# EAGLE design cdf-modular-bridge-rev2 (EAGLE 7.3.0)
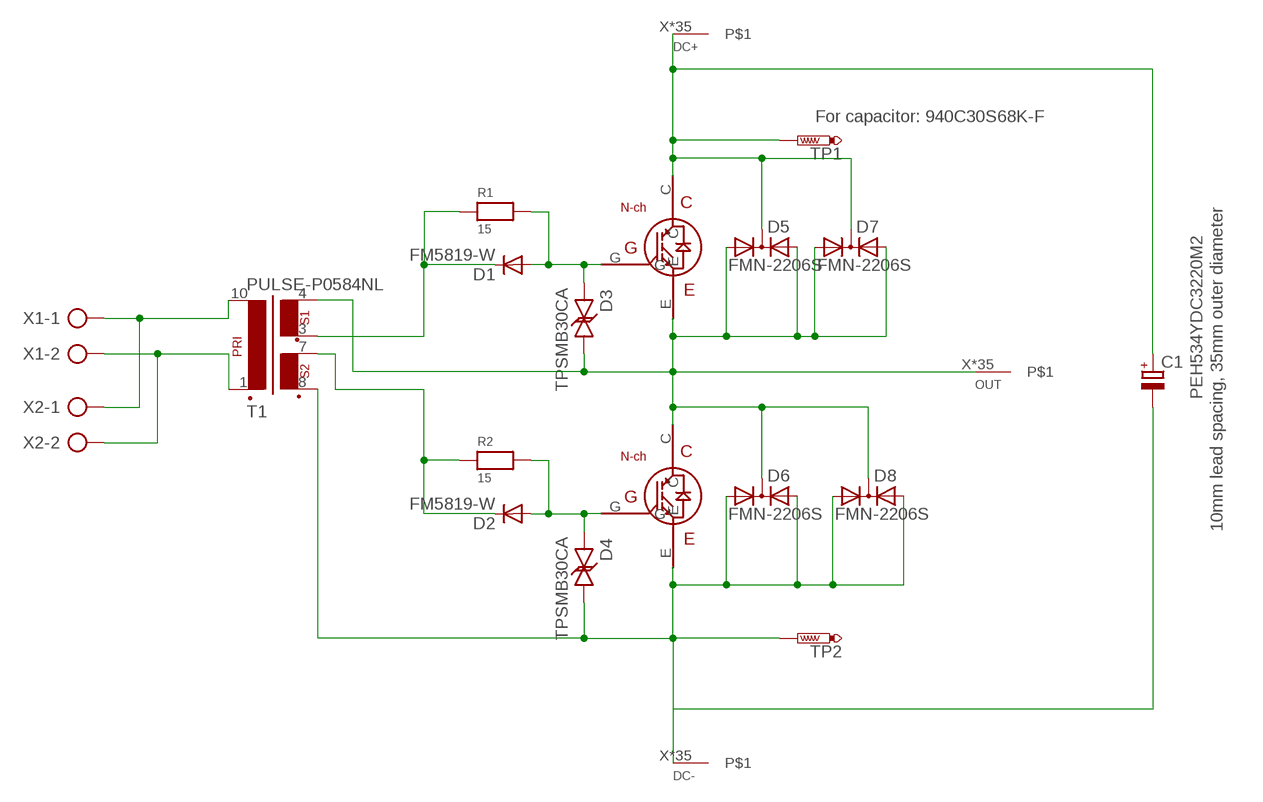
[diagram p0: schematic, sheet 1]

## Parts
C1  PEH534YDC3220M2  CPOL-EUE10-35  [EB35D]
D1  FM5819-W  S1A  [DO214AC]
D2  FM5819-W  S1A  [DO214AC]
D3  TPSMB30CA  TPSMB15CA  [TPSMB15CA]
D4  TPSMB30CA  TPSMB15CA  [TPSMB15CA]
D5  FMN-2206S  [TO220ABS]
D6  FMN-2206S  [TO220ABS]
D7  FMN-2206S  [TO220ABS]
D8  FMN-2206S  [TO220ABS]
DC+  BIG-ASS-HOLE  [BIG-ASS-HOLE]
DC-  BIG-ASS-HOLE  [BIG-ASS-HOLE]
OUT  BIG-ASS-HOLE  [BIG-ASS-HOLE]
Q1  Ixgh48n60a3  IXGH40N60A  [IXGH40N60A]
Q2  Ixgh48n60a3  IXGH40N60A  [IXGH40N60A]
R1  15  RESISTOR1206  [1206]
R2  15  RESISTOR1206  [1206]
T1  PULSE-P0584NL  [PULSE-P0584NL]
TP1  PTR1PAD1-17  [P1-17]
TP2  PTR1PAD1-17  [P1-17]
X1  AK500/2  [AK500/2]
X2  AK500/2  [AK500/2]

## Nets
DC+: C1.+ D5.C D7.C DC+.X DC+.X@1 DC+.X@2 DC+.X@3 DC+.X@4 DC+.X@5 DC+.X@6 DC+.X@7 DC+.X@8 DC+.X@9 DC+.X@10 DC+.X@11 DC+.X@12 DC+.X@13 DC+.X@14 DC+.X@15 DC+.X@16 DC+.X@17 DC+.X@18 DC+.X@19 DC+.X@20 DC+.X@21 DC+.X@22 DC+.X@23 DC+.X@24 DC+.X@25 DC+.X@26 DC+.X@27 DC+.X@28 DC+.X@29 DC+.X@30 DC+.X@31 DC+.X@32 DC+.X@34 DC+.X@120 Q1.C TP1.TP
DC-: C1.- D4.P$2 D6.A1 D6.A2 D8.A1 D8.A2 DC-.X DC-.X@1 DC-.X@2 DC-.X@3 DC-.X@4 DC-.X@5 DC-.X@6 DC-.X@7 DC-.X@8 DC-.X@9 DC-.X@10 DC-.X@11 DC-.X@12 DC-.X@13 DC-.X@14 DC-.X@15 DC-.X@16 DC-.X@17 DC-.X@18 DC-.X@19 DC-.X@20 DC-.X@21 DC-.X@22 DC-.X@23 DC-.X@24 DC-.X@25 DC-.X@26 DC-.X@27 DC-.X@28 DC-.X@29 DC-.X@30 DC-.X@31 DC-.X@32 DC-.X@34 DC-.X@120 Q2.E T1.8(SEC2_POS) TP2.TP
N$1: T1.10(PRI_NEG) X1.1 X2.1
N$2: T1.1(PRI_POS) X1.2 X2.2
N$3: D1.A D3.P$1 Q1.G R1.2
N$5: D2.A D4.P$1 Q2.G R2.2
N$7: D2.C R2.1 T1.7(SEC2_NEG)
N$8: D1.C R1.1 T1.3(SEC1_POS)
OUT: D3.P$2 D5.A1 D5.A2 D6.C D7.A1 D7.A2 D8.C OUT.X OUT.X@1 OUT.X@2 OUT.X@3 OUT.X@4 OUT.X@5 OUT.X@6 OUT.X@7 OUT.X@8 OUT.X@9 OUT.X@10 OUT.X@11 OUT.X@12 OUT.X@13 OUT.X@14 OUT.X@15 OUT.X@16 OUT.X@17 OUT.X@18 OUT.X@19 OUT.X@20 OUT.X@21 OUT.X@22 OUT.X@23 OUT.X@24 OUT.X@25 OUT.X@26 OUT.X@27 OUT.X@28 OUT.X@29 OUT.X@30 OUT.X@31 OUT.X@32 OUT.X@34 OUT.X@120 Q1.E Q2.C T1.4(SEC1_NEG)

## Notes on the sheet
- For capacitor: 940C30S68K-F
- 10mm lead spacing, 35mm outer diameter

## Library data of the parts
C1 = rcl:CPOL-EU: POLARIZED CAPACITOR, European symbol
D1 D2 = s1x_10:S1*: S1A - S1M General Purpose Rectifiers Source: http://www.fairchildsemi.com/datasheets/S1/S1A.pdf; MF: Fairchild; MPN: S1A; OC_FARNELL: 9843868; OC_NEWARK: 58K9551
D3 D4 = keves:TPSMB15CA
D5-D8 = keves:FMN-2206S
DC+ DC- OUT = keves:BIG-ASS-HOLE
Q1 Q2 = keves:IXGH40N60A
R1 R2 = microbuilder:RESISTOR: Resistors 0402 - 0402 Surface Mount Package 22 Ohm 1% 1/16W [Digikey: 311-22.0LRTR-ND] 33 Ohm 5% 1/16W 1.0K 5% 1/16W 1.5K 5% 1/16W 2.0K 1% 1/16W 10.0K 1% 1/16W [Digikey: 311-10.0KLRTR-ND] 10.0K 5% 1/16W [Digikey: RMCF0402JT10K0TR-ND] 12.1K 1% 1/16W [Digikey: 311-22.0LRTR-ND] 100.0K 5% 1/16W 0603 - 0603 Surface Mount Package 0 Ohm 1/10 Watt 1% Resistor 15 Ohm 1/10 Watt 1% Resistor 33 Ohm 1/10 Watt 1% Resistor 49.9 Ohm 1/10 Watt 1% Resistor 100 Ohm 1/10 Watt 1% Resistor 150 Ohm 1/10 Watt 1% Resistor 240 Ohm 1/10 Watt 1% Resistor 390 Ohm 1/10 Watt 1% Resistor 560 Ohm 1/10 Watt 1% Resistor 680 Ohm 1/10 Watt 1% Resistor 750 Ohm 1/10 Watt 1% Resistor 1.0K Ohm 1/10 Watt 1% Resistor 1.5K Ohm 1/10 Watt 1% Resistor 2.0K Ohm 1/10 Watt 1% Resistor 2.2K Ohm 1/10 Watt 1% Resistor 3.3K Ohm 1/10 Watt 1% Resistor 4.7K Ohm 1/10 Watt 1% Resistor 10.0K Ohm 1/10 Watt 1% Resistor 12.0K Ohm 1/10 Watt 1% Resistor 12.1K Ohm 1/10 Watt 1% Resistor 20.0K Ohm 1/10 Watt 1% Resistor 33.0K Ohm 1/10 Watt 1% Resistor 100.0K Ohm 1/10 Watt 1% Resistor 0805 - 0805 Surface Mount Package 0 Ohm 1/8 Watt 1% Resistor 33 Ohm 1/8 Watt 1% Resistor 100 Ohm 1/8 Watt 1% Resistor 150 Ohm 1/8 Watt 1% Resistor 200 Ohm 1/8 Watt 1% Resistor 240 Ohm 1/8 Watt 1% Resistor 330 Ohm 1/8 Watt 1% Resistor 390 Ohm 1/8 Watt 1% Resistor 470 Ohm 1/8 Watt 1% Resistor 1.0K Ohm 1/8 Watt 1% Resistor 1.5K Ohm 1/8 Watt 1% Resistor 2.0K Ohm 1/8 Watt 1% Resistor 4.7K Ohm 1/8 Watt 1% Resistor 5.1K Ohm 1/8 Watt 1% Resistor 5.6K Ohm 1/8 Watt 1% Resistor 10.0K Ohm 1/8 Watt 1% Resistor 22.0K Ohm 1/8 Watt 1% Resistor 33.0K Ohm 1/8 Watt 1% Resistor 100K Ohm 1/8 Watt 1% Resistor 1206 - 1206 Surface Mount Package 2012 - 2010 Surface Mount Package 0.11 Ohm 1/2 Watt 1% Resistor - Digikey: RHM.11UCT-ND
T1 = keves:PULSE-P0584NL
TP1 TP2 = testpad:PTR1: TEST PIN
X1 X2 = con-ptr500:AK500/2: CONNECTOR; OC_FARNELL: unknown; OC_NEWARK: unknown

## Board
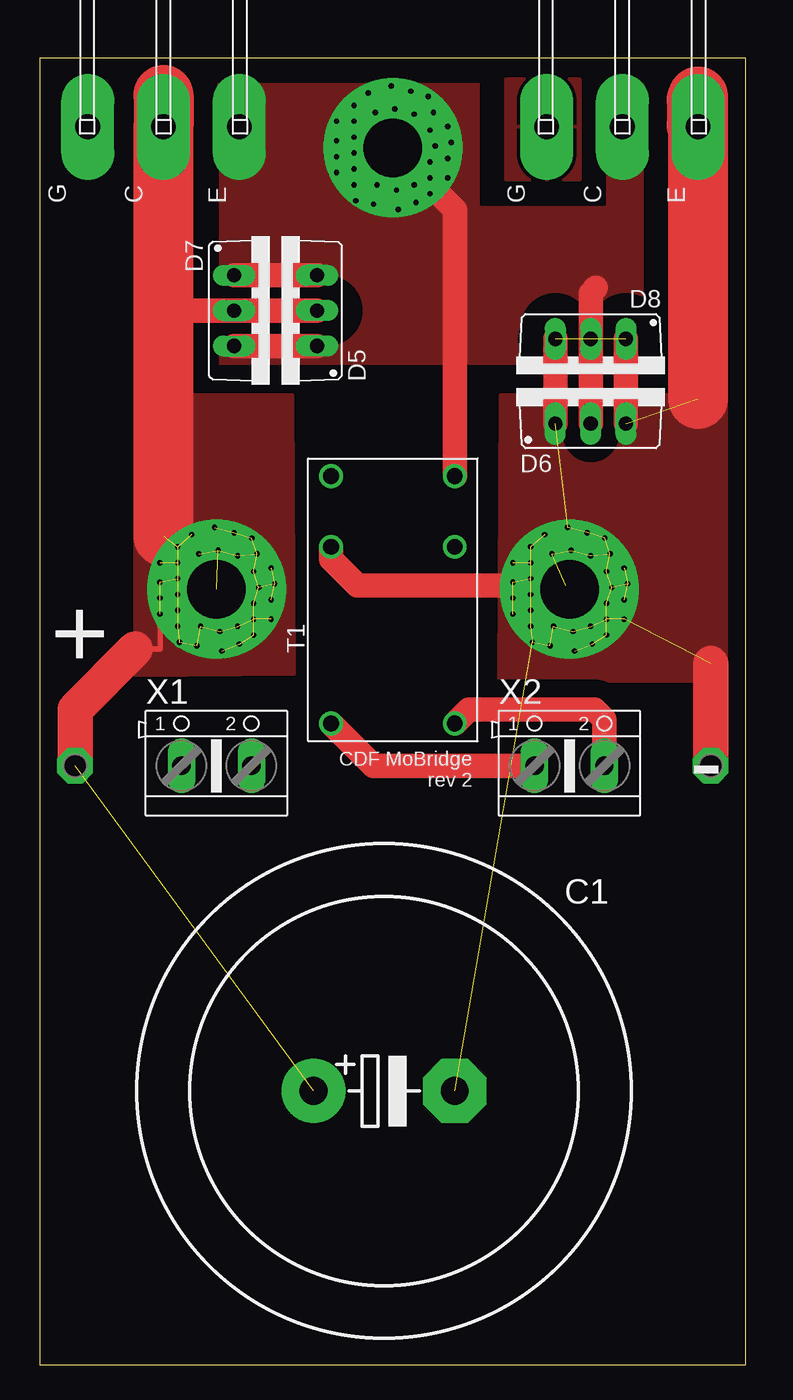
[diagram p1: board, top side]
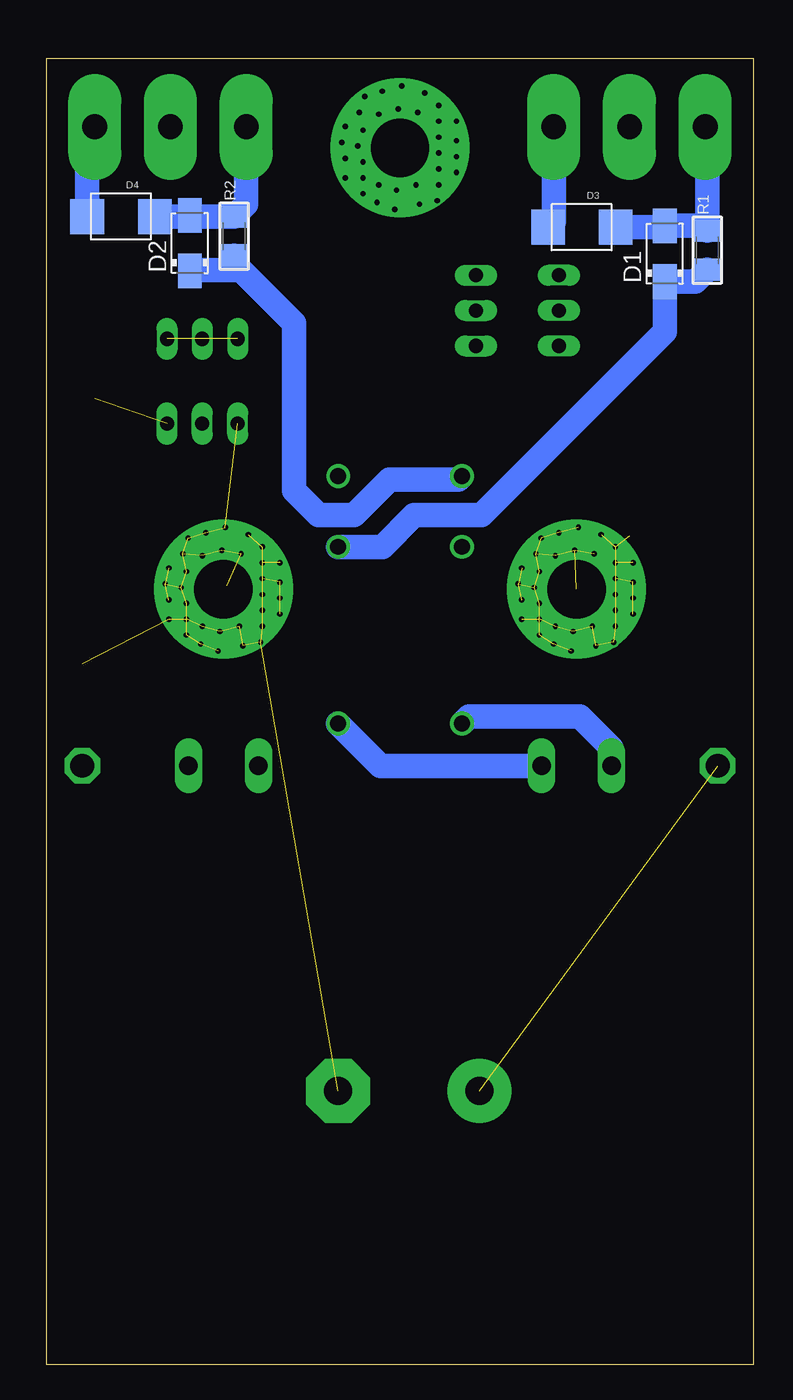
[diagram p2: board, bottom side, seen from below]

Size 50.8 x 93.98 mm. Coordinates in mm from the lower left corner, seen from the top.
Outline: 0,0 50.8,0 50.8,93.98 0,93.98 0,0
Copper layers (1*16): Top 0.0356mm / dielectric 1.5011mm / Bottom 0.0356mm
Design rules "oshpark *": minimum track width 6mil, minimum drill 13mil, track to track 6mil, track to pad 6mil, pad to pad 6mil, via to via 6mil, smd to smd 6mil, copper to edge 15mil, drill to drill 6mil, minimum pad ring 7mil, minimum via ring 7mil, stop-mask expansion 3mil, vias tented up to drill 0mil, thermal gap 10mil

### Footprints (pad centres in the part's own frame; a part is rotated, then mirrored left to right if it is on the bottom)
EB35D = drill 2.007 pad 4.597: + -5.08,0 | drill 2.007 pad 4.597 octagon: - 5.08,0
DO214AC = smd 2.5 x 1.7: A 2,0; C -2,0
TPSMB15CA = smd 2.413 x 2.515: P$1 -2.438,0; P$2 2.438,0
TO220ABS = drill 1.016 long: A1 -2.54,-2.54; A2 2.54,-2.54; C 0,-2.54
BIG-ASS-HOLE = drill 4.2 pad 10: X 0,0 | drill 0.381: X@1 -2.794,-2.667; X@2 -2.794,-1.524; X@3 -2.794,-0.381; X@4 -2.794,0.762; X@5 -2.794,1.905; X@6 -2.794,3.048; X@7 2.54,3.683; X@8 2.921,2.54; X@9 -4.064,-1.778; X@10 -4.064,-0.635; X@11 -4.064,0.508; X@12 -4.064,1.905; X@13 2.667,1.27; X@14 3.048,0.127; X@15 2.667,-1.016; X@16 2.667,-2.159; X@17 2.667,-3.302; X@18 3.937,1.524; X@19 4.191,0.381; X@20 3.937,-0.762; X@21 3.937,-2.159; X@22 1.524,2.413; X@23 0.127,2.794; X@24 -1.27,2.54; X@25 -1.778,3.937; X@26 -0.127,4.445; X@27 1.27,4.064; X@28 1.524,-2.667; X@29 1.651,-3.937; X@30 0.254,-3.048; X@31 -1.143,-2.667; X@32 -1.397,-4.064; X@34 0.381,-4.445; X@120 -2.667,-3.81
IXGH40N60A = drill 1.778 pad 3.81 long: C -44.21,0; E -44.21,-5.45; G -44.21,5.45
1206 = smd 1.6 x 1.8: 1 -1.4,0; 2 1.4,0
PULSE-P0584NL = drill 1.143: 1 -12.7,-4.445; 3 0,-4.445; 4 5.08,-4.445; 7 5.08,4.445; 8 0,4.445; 10 -12.7,4.445
P1-17 = drill 1.702 pad 2.54 octagon: TP 0,0
AK500/2 = drill 1.321 long: 1 -2.515,0; 2 2.515,0

### Placement (x,y rotation side)
C1  24.77,19.69 0 top
D1  6.35,79.91 90 bottom
D2  40.51,80.67 90 bottom
D3  12.32,81.81 180 bottom
D4  45.47,82.58 180 bottom
D5  17.4,75.82 90 top
D6  39.62,70.23 0 top
D7  16.51,75.82 270 top
D8  39.62,71.25 180 top
DC+  12.7,55.78 0 top
DC-  38.1,55.78 0 top
OUT  25.4,87.53 0 top
Q1  8.89,133.25 90 top
Q2  41.91,133.25 90 top
R1  3.3,80.16 90 bottom
R2  37.34,81.18 90 bottom
T1  25.4,58.83 90 top
TP1  2.54,43.08 0 top
TP2  48.26,43.08 0 top
X1  12.7,43.08 0 top
X2  38.1,43.08 0 top

### Tracks (layer width: path | path; a pad name or v marks a point on that pad's centre or on a via)
DC+  (36 unrouted)
  Top 0.406: 6.86,51.46 8.64,51.46 DC+.X@9
  Top 1.778: D5.C D7.C 9.27,75.82 8.89,76.2
  Top 2.54: TP1.TP 2.54,47.14 6.86,51.46
  Top 4.318: 8.89,59.59 8.89,76.2 Q1.C 8.89,91.34
  pour Top (isolate 1.194, rank 3, no thermals): 18.16,69.75 6.86,69.75 6.86,49.56 18.29,49.68
DC-  (39 unrouted)
  Top 1.778: T1.8 20.95,57.94 22.86,56.03 37.85,56.03 DC-.X | D8.A2 D6.A1 | D8.A1 D6.A2
  Top 2.54: TP2.TP 48.26,50.44
  Top 4.318: 47.36,69.48 Q2.E | Q2.E 47.36,91.22 | 47.24,90.96 47.24,89.15 Q2.E
  Bottom 1.778: D4.P$2 47.9,88.49 Q2.E
  pour Top (isolate 1.27, rank 3, no thermals): 50.16,69.75 33.15,69.75 33.02,49.17 50.04,49.17
N$1
  Top 1.778: X2.1 24,43.08 T1.10
  Bottom 1.778: X1.1 10.19,44.37 12.45,46.63 20.45,46.63 T1.10
N$2
  Top 1.778: X2.2 40.62,46.41 39.88,47.14 30.86,47.14 T1.1
  Bottom 1.778: X1.2 26.8,43.08 T1.1
N$3
  Bottom 1.778: D3.P$1 6.45,81.81 D1.A 3.65,81.91 R1.2 3.3,88.9 Q1.G
N$5
  Bottom 1.778: D4.P$1 40.61,82.58 D2.A 40.42,82.58 R2.2 36.46,83.46 Q2.G
  pour Top: 33.53,92.46 38.86,92.46 38.86,85.22 33.53,85.22
N$7
  Bottom 1.778: T1.7 21.21,63.65 26.16,63.65 28.7,61.11 31.27,61.11 33.02,62.87 33.02,74.93 36.83,78.74 37.47,78.74 | 37.47,78.74 40.44,78.74 D2.C | R2.1 37.34,79.5 37.47,79.38 37.47,78.74
N$8
  Bottom 1.778: R1.1 4.16,77.91 D1.C 6.35,74.32 19.56,61.11 24.38,61.11 26.67,58.83 T1.3
OUT
  Top 1.778: T1.4 29.84,83.08 OUT.X | D7.A2 D5.A1 | D7.A1 D5.A2 | 40.01,77.47 39.62,77.09 D8.C D6.C
  Bottom 1.778: Q1.E 14.34,82.23 D3.P$2
  pour Top (isolate 1.778, rank 2, no thermals): 43.81,94.39 12.45,94.39 12.45,72.03 43.81,72.03

### Text on the board
tPlace: READD tSTOP LAYER!!! | + | CDF MoBridge / rev 2 | -